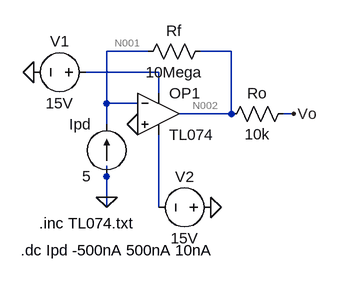
[diagram p0: schematic 4_4_1_b.asc]
4_4_1_b.asc, the LTspice schematic file:
Version 4
SHEET 1 880 680
WIRE 176 16 112 16
WIRE 304 16 256 16
WIRE 192 48 80 48
WIRE 192 80 192 48
WIRE 112 96 112 16
WIRE 160 96 112 96
WIRE 304 112 304 16
WIRE 304 112 224 112
WIRE 400 112 384 112
WIRE 112 128 112 96
WIRE 112 208 112 192
WIRE 112 240 112 208
WIRE 112 256 112 240
WIRE 192 256 192 144
FLAG 272 256 0
FLAG 0 48 0
FLAG 160 128 0
FLAG 112 240 0
FLAG 400 112 Vo
SYMBOL voltage 96 48 R90
WINDOW 0 -32 56 VBottom 2
WINDOW 3 32 56 VTop 2
SYMATTR InstName V1
SYMATTR Value 15V
SYMBOL voltage 288 256 R90
WINDOW 0 -32 56 VBottom 2
WINDOW 3 32 56 VTop 2
SYMATTR InstName V2
SYMATTR Value 15V
SYMBOL Opamps\\opamp2 192 48 R0
SYMATTR InstName OP1
SYMATTR Value TL074
SYMBOL res 272 0 R90
WINDOW 0 0 56 VBottom 2
WINDOW 3 32 56 VTop 2
SYMATTR InstName Rf
SYMATTR Value 10Mega
SYMBOL res 400 96 R90
WINDOW 0 0 56 VBottom 2
WINDOW 3 32 56 VTop 2
SYMATTR InstName Ro
SYMATTR Value 10k
SYMBOL current 112 208 R180
WINDOW 0 24 80 Left 2
WINDOW 3 24 0 Left 2
WINDOW 123 0 0 Left 0
WINDOW 39 0 0 Left 0
SYMATTR InstName Ipd
SYMATTR Value 5
TEXT 8 280 Left 2 !.inc TL074.txt
TEXT -20 322 Left 2 !.dc Ipd -500nA 500nA 10nA

The netlist it stands for:
* 4_4_1_b.asc
V1 N003 0 15V
V2 0 N004 15V
XOP1 0 N001 N003 N004 N002 TL074  ; pins In+ In- V+ V- OUT
Rf N002 N001 10Mega
Ro Vo N002 10k
Ipd 0 N001 5
.inc TL074.txt
.dc Ipd -500nA 500nA 10nA
.backanno
.end

* Results of the author's LTspice run, read from the files saved beside the schematic
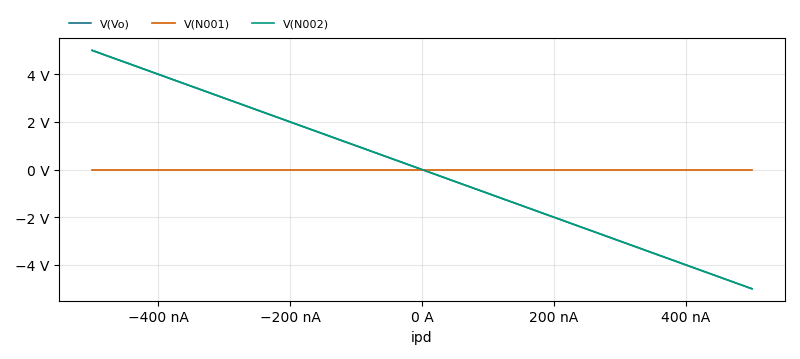
[diagram p1: DC transfer characteristic of 4_4_1_b.asc, plotted from the saved traces]
* DC transfer characteristic, 1 run:
*   V(Vo): 5 V at ipd=-500 nA, -5 V at ipd=500 nA, min -5 V, max 5 V
*   V(N001): -10.83 µV at ipd=-500 nA, 32.76 µV at ipd=500 nA, min -10.83 µV, max 32.76 µV
*   V(N002): 5 V at ipd=-500 nA, -5 V at ipd=500 nA, min -5 V, max 5 V